# Altium schematic sheet Archi.SchDoc
size A4; Author: PM; SheetNumber: 1
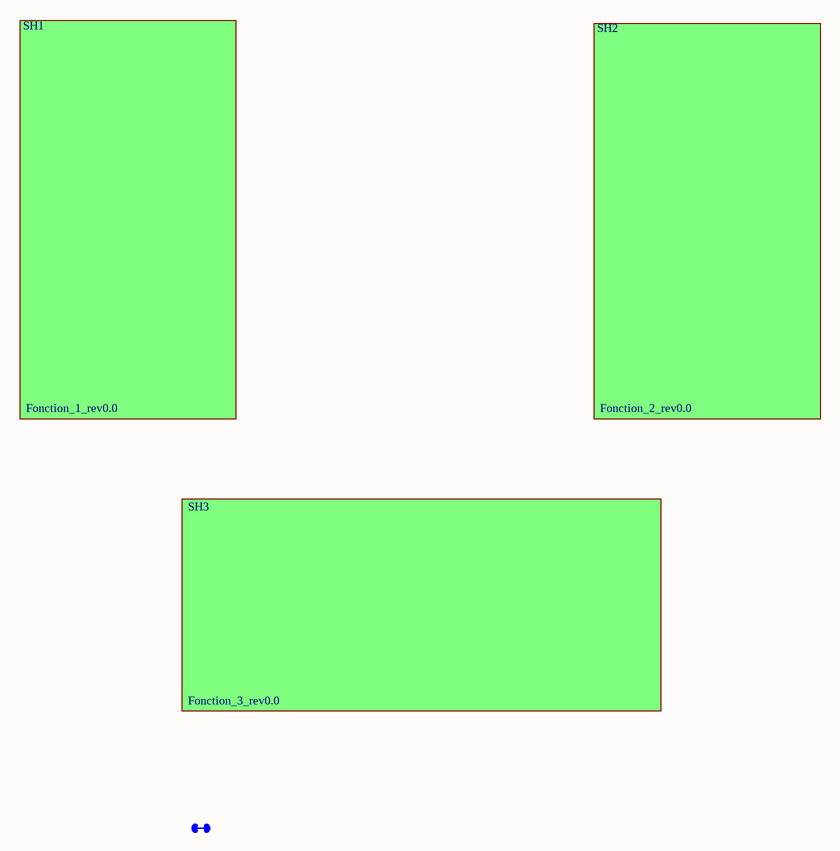
[diagram p0: Archi.SchDoc]

## Sub-sheets
SH1 = Fonction_1_rev0.0: no entries
SH2 = Fonction_2_rev0.0: no entries
SH3 = Fonction_3_rev0.0: no entries

## Notes on the sheet
- TEXT
- : power label
- : external ground connexion
- : peripheral used
- Text
- : schematic sheet
- : boc function
- : power line connexion
- : signal refered to a power
- : antenna 50ohm connexion
- : external connexion
- : connectors/buttons/LED
- Project:
- Size:
- Date:
- A4
- Author:
- Time:
- PCB:
- Revision:
- Sheet:
- of
- .
- (text)
- : net name
- : signal line connexion
- : comments
- File: